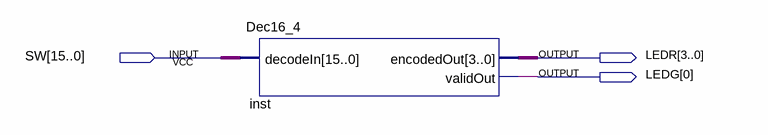
[diagram p0: schematic sheet]
// Quartus schematic Dec16_4Demo.bdf as structural Verilog: 1 symbols, 3 pins
module Dec16_4Demo (
  input  [15:0] SW,
  output [3:0] LEDR,
  output [0:0] LEDG
);

  Dec16_4 inst (.decodeIn(SW), .encodedOut(LEDR), .validOut(LEDG[0]));
endmodule
